# Altium schematic sheet Sheet1.SchDoc
size A4; SheetNumber: 1; SheetTotal: 1
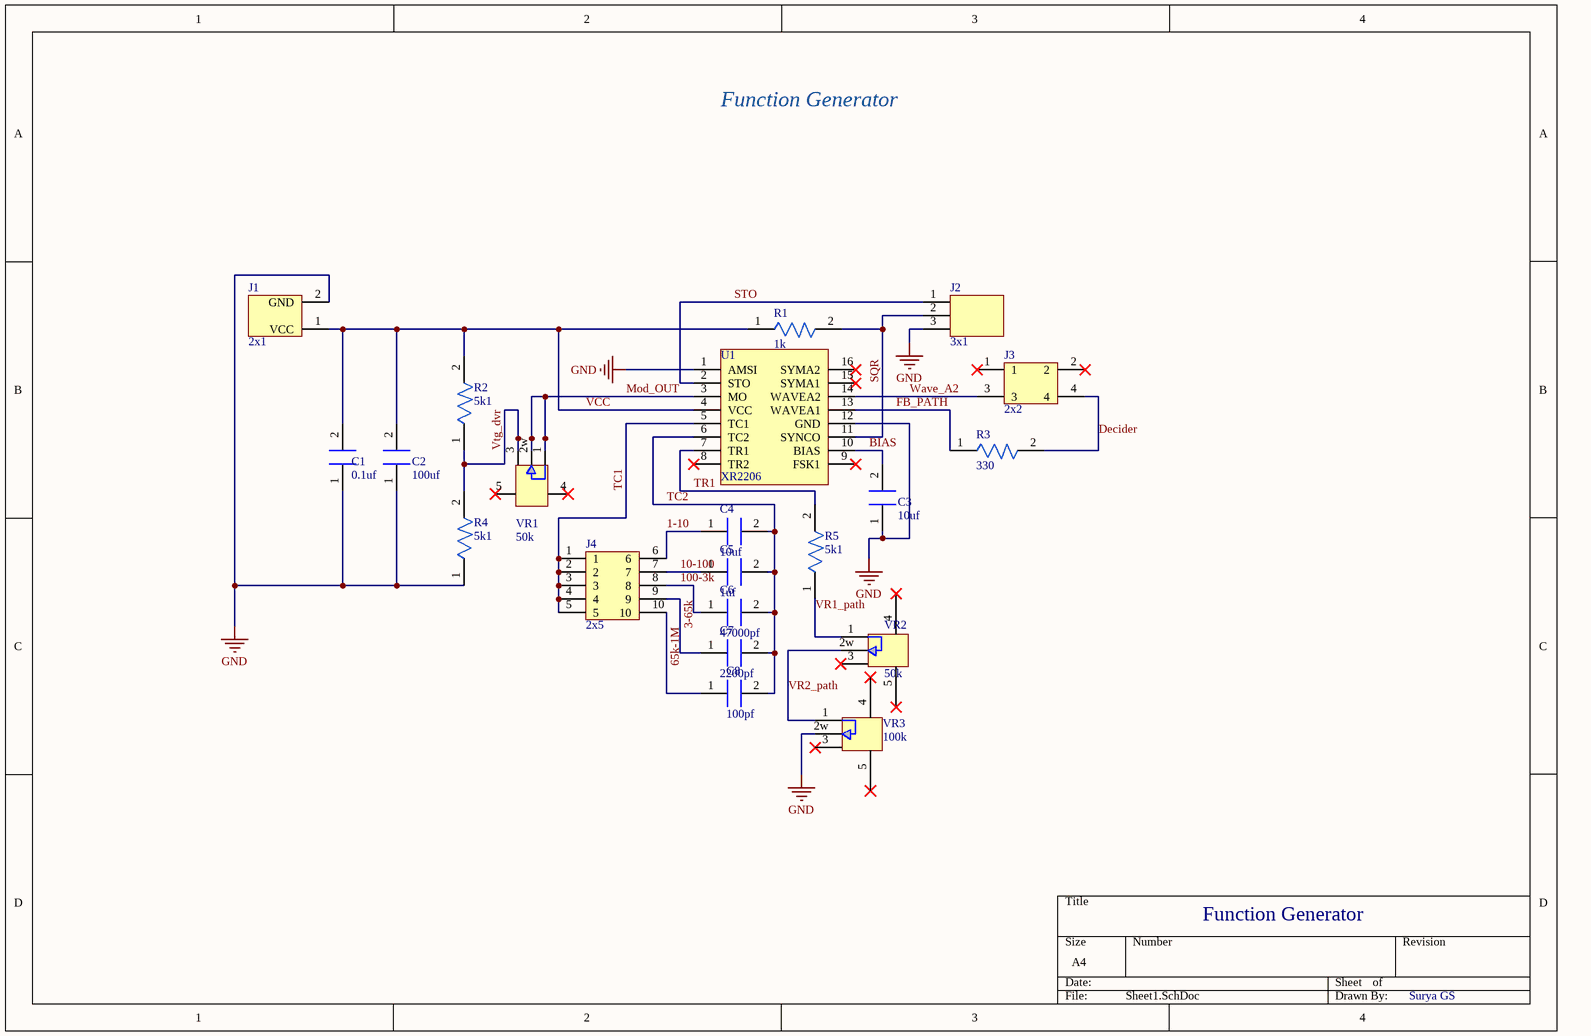
[diagram p0: Sheet1.SchDoc]

## Parts
C1  0.1uf  [PCBComponent_1]
C2  100uf  [PCBComponent_1]
C3  10uf  [PCBComponent_1]
C4  10uf  [PCBComponent_1]
C5  1uf  [PCBComponent_1]
C6  47000pf  [PCBComponent_1]
C7  2200pf  [PCBComponent_1]
C8  100pf  [PCBComponent_1]
J1  2x1  [PCBComponent_1 - duplicate4]
J2  3x1  [PCBComponent_1 - duplicate7]
J3  2x2  [PCBComponent_1 - duplicate6]
J4  2x5  [PCBComponent_1 - duplicate5]
R1  1k  [PCBComponent_1 - duplicate]
R2  5k1  [PCBComponent_1 - duplicate]
R3  330  [PCBComponent_1 - duplicate]
R4  5k1  [PCBComponent_1 - duplicate]
R5  5k1  [PCBComponent_1 - duplicate]
U1  XR2206  [PCBComponent_1 - duplicate2]
VR1  50k  [PCBComponent_1 - duplicate3]
VR2  50k  [PCBComponent_1 - duplicate3]
VR3  100k  [PCBComponent_1 - duplicate3]

## Nets
GND: C1.1 C2.1 C3.1 J1.2(GND) J2.3(GND) R4.1 U1.1(AMSI) U1.12(GND) VR3.2w(WPR)
1-10: C4.1 J4.6
3-65k: C7.1 J4.9
10-100: C5.1 J4.7
65k-1M: C8.1 J4.10
100-3k: C6.1 J4.8
BIAS: C3.2 U1.10(BIAS)
Decider: J3.4 R3.2
FB_PATH: R3.1 U1.13(WAVEA1)
Mod_OUT: U1.3(MO) VR1.1 VR1.2w(WPR)
SQR: J2.2(SQU) R1.2 U1.11(SYNCO)
STO: J2.1(SIN/TRI) U1.2(STO)
TC1: J4.1 J4.2 J4.3 J4.4 J4.5 U1.5(TC1)
TC2: C4.2 C5.2 C6.2 C7.2 C8.2 U1.6(TC2)
TR1: R5.2 U1.7(TR1)
VCC: C1.2 C2.2 J1.1(VCC) R1.1 R2.2 U1.4(VCC)
VR1_path: R5.1 VR2.1
VR2_path: VR2.2w(WPR) VR3.1
Vtg_dvr: R2.1 R4.2 VR1.3
Wave_A2: J3.3 U1.14(WAVEA2)

Not connected (* = marked no-connect by the designer): J3 1* 2*; U1 8(TR2)* 9(FSK1)* 15(SYMA1)* 16(SYMA2)*; VR1 4(WPR)* 5(WPR)*; VR2 3(12)* 4(WPR)* 5(WPR)*; VR3 3(12)* 4(WPR)* 5(WPR)*

## Notes on the sheet
- Function Generator
- Surya GS

## Library data of the parts
C1 = Capacitor_3: Manufacturer: United Chemi-Con; Manufacturer Part Number: KTD101B107M99A0B00; Value: 100µF; Dielectric Material: Ceramic; Lead/Base Style: Straight; Tolerance: 20%; Voltage Rating: 100V; Supplier: DigiKey; Supplier Part Number: 565-KTD101B107M99A0B00-ND; RoHS: Compliant; Category: Ceramic Capacitors; Stock: 1030; Pricing: 1=30.55, 10=24.126, 50=22.6442, 100=21.9445 (USD); Case/Package: Radial; China RoHS: Compliant; Contact Plating: Tin; Height: 20mm; Height - Seated (Max): 20.0152mm; Lead Pitch: 24.9936mm; Length: 28.5mm; Lifecycle Status: Production; Max Operating Temperature: 125°C; Min Operating Temperature: -55°C; Mounting Technology: Through Hole; Number of Terminals: 2; REACH SVHC: Yes; Terminal Pitch: 25mm; Voltage Rating (DC): 100V; Width: 9mm; ComponentLink1URL: https://datasheet.octopart.com:443/KTD101B107M99A0B00-Nippon-Chemicon-datasheet-182100469.pdf?src-supplier=IHS; ComponentLink1Description: https://datasheet.octopart.com:443/KTD101B107M99A0B00-Nippon-Chemicon-datasheet-182100469.pdf?src-supplier=IHS; ComponentLink2URL: https://datasheet.octopart.com:443/KTD101B107M99A0B00-United-Chemi-Con-datasheet-154730662.pdf?src-supplier=Electro+Sonic; ComponentLink2Description: https://datasheet.octopart.com:443/KTD101B107M99A0B00-United-Chemi-Con-datasheet-154730662.pdf?src-supplier=Electro+Sonic
C2 = Capacitor: Manufacturer: United Chemi-Con; Manufacturer Part Number: KTD101B107M99A0B00; Value: 100µF; Dielectric Material: Ceramic; Lead/Base Style: Straight; Tolerance: 20%; Voltage Rating: 100V; Supplier: DigiKey; Supplier Part Number: 565-KTD101B107M99A0B00-ND; RoHS: Compliant; Category: Ceramic Capacitors; Stock: 1030; Pricing: 1=30.55, 10=24.126, 50=22.6442, 100=21.9445 (USD); Case/Package: Radial; China RoHS: Compliant; Contact Plating: Tin; Height: 20mm; Height - Seated (Max): 20.0152mm; Lead Pitch: 24.9936mm; Length: 28.5mm; Lifecycle Status: Production; Max Operating Temperature: 125°C; Min Operating Temperature: -55°C; Mounting Technology: Through Hole; Number of Terminals: 2; REACH SVHC: Yes; Terminal Pitch: 25mm; Voltage Rating (DC): 100V; Width: 9mm; ComponentLink1URL: https://datasheet.octopart.com:443/KTD101B107M99A0B00-Nippon-Chemicon-datasheet-182100469.pdf?src-supplier=IHS; ComponentLink1Description: https://datasheet.octopart.com:443/KTD101B107M99A0B00-Nippon-Chemicon-datasheet-182100469.pdf?src-supplier=IHS; ComponentLink2URL: https://datasheet.octopart.com:443/KTD101B107M99A0B00-United-Chemi-Con-datasheet-154730662.pdf?src-supplier=Electro+Sonic; ComponentLink2Description: https://datasheet.octopart.com:443/KTD101B107M99A0B00-United-Chemi-Con-datasheet-154730662.pdf?src-supplier=Electro+Sonic
C3 = Capacitor_4: Manufacturer: United Chemi-Con; Manufacturer Part Number: KTD101B107M99A0B00; Value: 100µF; Dielectric Material: Ceramic; Lead/Base Style: Straight; Tolerance: 20%; Voltage Rating: 100V; Supplier: DigiKey; Supplier Part Number: 565-KTD101B107M99A0B00-ND; RoHS: Compliant; Category: Ceramic Capacitors; Stock: 1030; Pricing: 1=30.55, 10=24.126, 50=22.6442, 100=21.9445 (USD); Case/Package: Radial; China RoHS: Compliant; Contact Plating: Tin; Height: 20mm; Height - Seated (Max): 20.0152mm; Lead Pitch: 24.9936mm; Length: 28.5mm; Lifecycle Status: Production; Max Operating Temperature: 125°C; Min Operating Temperature: -55°C; Mounting Technology: Through Hole; Number of Terminals: 2; REACH SVHC: Yes; Terminal Pitch: 25mm; Voltage Rating (DC): 100V; Width: 9mm; ComponentLink1URL: https://datasheet.octopart.com:443/KTD101B107M99A0B00-Nippon-Chemicon-datasheet-182100469.pdf?src-supplier=IHS; ComponentLink1Description: https://datasheet.octopart.com:443/KTD101B107M99A0B00-Nippon-Chemicon-datasheet-182100469.pdf?src-supplier=IHS; ComponentLink2URL: https://datasheet.octopart.com:443/KTD101B107M99A0B00-United-Chemi-Con-datasheet-154730662.pdf?src-supplier=Electro+Sonic; ComponentLink2Description: https://datasheet.octopart.com:443/KTD101B107M99A0B00-United-Chemi-Con-datasheet-154730662.pdf?src-supplier=Electro+Sonic
C4 = Capacitor_5: Manufacturer: United Chemi-Con; Manufacturer Part Number: KTD101B107M99A0B00; Value: 100µF; Dielectric Material: Ceramic; Lead/Base Style: Straight; Tolerance: 20%; Voltage Rating: 100V; Supplier: DigiKey; Supplier Part Number: 565-KTD101B107M99A0B00-ND; RoHS: Compliant; Category: Ceramic Capacitors; Stock: 1030; Pricing: 1=30.55, 10=24.126, 50=22.6442, 100=21.9445 (USD); Case/Package: Radial; China RoHS: Compliant; Contact Plating: Tin; Height: 20mm; Height - Seated (Max): 20.0152mm; Lead Pitch: 24.9936mm; Length: 28.5mm; Lifecycle Status: Production; Max Operating Temperature: 125°C; Min Operating Temperature: -55°C; Mounting Technology: Through Hole; Number of Terminals: 2; REACH SVHC: Yes; Terminal Pitch: 25mm; Voltage Rating (DC): 100V; Width: 9mm; ComponentLink1URL: https://datasheet.octopart.com:443/KTD101B107M99A0B00-Nippon-Chemicon-datasheet-182100469.pdf?src-supplier=IHS; ComponentLink1Description: https://datasheet.octopart.com:443/KTD101B107M99A0B00-Nippon-Chemicon-datasheet-182100469.pdf?src-supplier=IHS; ComponentLink2URL: https://datasheet.octopart.com:443/KTD101B107M99A0B00-United-Chemi-Con-datasheet-154730662.pdf?src-supplier=Electro+Sonic; ComponentLink2Description: https://datasheet.octopart.com:443/KTD101B107M99A0B00-United-Chemi-Con-datasheet-154730662.pdf?src-supplier=Electro+Sonic
C5 = Capacitor_1: Manufacturer: United Chemi-Con; Manufacturer Part Number: KTD101B107M99A0B00; Value: 100µF; Dielectric Material: Ceramic; Lead/Base Style: Straight; Tolerance: 20%; Voltage Rating: 100V; Supplier: DigiKey; Supplier Part Number: 565-KTD101B107M99A0B00-ND; RoHS: Compliant; Category: Ceramic Capacitors; Stock: 1030; Pricing: 1=30.55, 10=24.126, 50=22.6442, 100=21.9445 (USD); Case/Package: Radial; China RoHS: Compliant; Contact Plating: Tin; Height: 20mm; Height - Seated (Max): 20.0152mm; Lead Pitch: 24.9936mm; Length: 28.5mm; Lifecycle Status: Production; Max Operating Temperature: 125°C; Min Operating Temperature: -55°C; Mounting Technology: Through Hole; Number of Terminals: 2; REACH SVHC: Yes; Terminal Pitch: 25mm; Voltage Rating (DC): 100V; Width: 9mm; ComponentLink1URL: https://datasheet.octopart.com:443/KTD101B107M99A0B00-Nippon-Chemicon-datasheet-182100469.pdf?src-supplier=IHS; ComponentLink1Description: https://datasheet.octopart.com:443/KTD101B107M99A0B00-Nippon-Chemicon-datasheet-182100469.pdf?src-supplier=IHS; ComponentLink2URL: https://datasheet.octopart.com:443/KTD101B107M99A0B00-United-Chemi-Con-datasheet-154730662.pdf?src-supplier=Electro+Sonic; ComponentLink2Description: https://datasheet.octopart.com:443/KTD101B107M99A0B00-United-Chemi-Con-datasheet-154730662.pdf?src-supplier=Electro+Sonic
C6 = Capacitor_2: Manufacturer: United Chemi-Con; Manufacturer Part Number: KTD101B107M99A0B00; Value: 100µF; Dielectric Material: Ceramic; Lead/Base Style: Straight; Tolerance: 20%; Voltage Rating: 100V; Supplier: DigiKey; Supplier Part Number: 565-KTD101B107M99A0B00-ND; RoHS: Compliant; Category: Ceramic Capacitors; Stock: 1030; Pricing: 1=30.55, 10=24.126, 50=22.6442, 100=21.9445 (USD); Case/Package: Radial; China RoHS: Compliant; Contact Plating: Tin; Height: 20mm; Height - Seated (Max): 20.0152mm; Lead Pitch: 24.9936mm; Length: 28.5mm; Lifecycle Status: Production; Max Operating Temperature: 125°C; Min Operating Temperature: -55°C; Mounting Technology: Through Hole; Number of Terminals: 2; REACH SVHC: Yes; Terminal Pitch: 25mm; Voltage Rating (DC): 100V; Width: 9mm; ComponentLink1URL: https://datasheet.octopart.com:443/KTD101B107M99A0B00-Nippon-Chemicon-datasheet-182100469.pdf?src-supplier=IHS; ComponentLink1Description: https://datasheet.octopart.com:443/KTD101B107M99A0B00-Nippon-Chemicon-datasheet-182100469.pdf?src-supplier=IHS; ComponentLink2URL: https://datasheet.octopart.com:443/KTD101B107M99A0B00-United-Chemi-Con-datasheet-154730662.pdf?src-supplier=Electro+Sonic; ComponentLink2Description: https://datasheet.octopart.com:443/KTD101B107M99A0B00-United-Chemi-Con-datasheet-154730662.pdf?src-supplier=Electro+Sonic
C7 = Capacitor_6: Manufacturer: United Chemi-Con; Manufacturer Part Number: KTD101B107M99A0B00; Value: 100µF; Dielectric Material: Ceramic; Lead/Base Style: Straight; Tolerance: 20%; Voltage Rating: 100V; Supplier: DigiKey; Supplier Part Number: 565-KTD101B107M99A0B00-ND; RoHS: Compliant; Category: Ceramic Capacitors; Stock: 1030; Pricing: 1=30.55, 10=24.126, 50=22.6442, 100=21.9445 (USD); Case/Package: Radial; China RoHS: Compliant; Contact Plating: Tin; Height: 20mm; Height - Seated (Max): 20.0152mm; Lead Pitch: 24.9936mm; Length: 28.5mm; Lifecycle Status: Production; Max Operating Temperature: 125°C; Min Operating Temperature: -55°C; Mounting Technology: Through Hole; Number of Terminals: 2; REACH SVHC: Yes; Terminal Pitch: 25mm; Voltage Rating (DC): 100V; Width: 9mm; ComponentLink1URL: https://datasheet.octopart.com:443/KTD101B107M99A0B00-Nippon-Chemicon-datasheet-182100469.pdf?src-supplier=IHS; ComponentLink1Description: https://datasheet.octopart.com:443/KTD101B107M99A0B00-Nippon-Chemicon-datasheet-182100469.pdf?src-supplier=IHS; ComponentLink2URL: https://datasheet.octopart.com:443/KTD101B107M99A0B00-United-Chemi-Con-datasheet-154730662.pdf?src-supplier=Electro+Sonic; ComponentLink2Description: https://datasheet.octopart.com:443/KTD101B107M99A0B00-United-Chemi-Con-datasheet-154730662.pdf?src-supplier=Electro+Sonic
C8 = Capacitor_7: Manufacturer: United Chemi-Con; Manufacturer Part Number: KTD101B107M99A0B00; Value: 100µF; Dielectric Material: Ceramic; Lead/Base Style: Straight; Tolerance: 20%; Voltage Rating: 100V; Supplier: DigiKey; Supplier Part Number: 565-KTD101B107M99A0B00-ND; RoHS: Compliant; Category: Ceramic Capacitors; Stock: 1030; Pricing: 1=30.55, 10=24.126, 50=22.6442, 100=21.9445 (USD); Case/Package: Radial; China RoHS: Compliant; Contact Plating: Tin; Height: 20mm; Height - Seated (Max): 20.0152mm; Lead Pitch: 24.9936mm; Length: 28.5mm; Lifecycle Status: Production; Max Operating Temperature: 125°C; Min Operating Temperature: -55°C; Mounting Technology: Through Hole; Number of Terminals: 2; REACH SVHC: Yes; Terminal Pitch: 25mm; Voltage Rating (DC): 100V; Width: 9mm; ComponentLink1URL: https://datasheet.octopart.com:443/KTD101B107M99A0B00-Nippon-Chemicon-datasheet-182100469.pdf?src-supplier=IHS; ComponentLink1Description: https://datasheet.octopart.com:443/KTD101B107M99A0B00-Nippon-Chemicon-datasheet-182100469.pdf?src-supplier=IHS; ComponentLink2URL: https://datasheet.octopart.com:443/KTD101B107M99A0B00-United-Chemi-Con-datasheet-154730662.pdf?src-supplier=Electro+Sonic; ComponentLink2Description: https://datasheet.octopart.com:443/KTD101B107M99A0B00-United-Chemi-Con-datasheet-154730662.pdf?src-supplier=Electro+Sonic
J1 = Header_2: Manufacturer: Sullins; Manufacturer Part Number: PPPC022LFBN-RC; Connector Type: Header, Socket; Current Rating: 3A; Dielectric Material: Polyester; Number of Positions: 4; Pitch: 2.54mm; Supplier: DigiKey; Supplier Part Number: S7105-ND; RoHS: Compliant; Category: Card Edge Connectors; Stock: 8090; Pricing: 1=0.46, 10=0.394, 100=0.3349, 500=0.29888, 1000=0.28461, 5000=0.25405, 10000=0.24193 (USD); Color: Black; Contact Gender: Female; Contact Material: Bronze; Contact Plating: Gold; Height: 8.5mm; Housing Material: Plastic; Lead Free: Lead Free; Length: 5.58mm; Lifecycle Status: Production; Mounting Technology: Through Hole; Pins: 4; Number of Rows: 2; Packaging: Bulk; REACH SVHC: Yes; Row Spacing: 2.54mm; Terminal Pitch: 2.54mm; Termination: Solder; Width: 5mm; ComponentLink1URL: https://datasheet.octopart.com:443/PPPC022LFBN-RC-Sullins-datasheet-138810743.pdf?src-supplier=IHS; ComponentLink1Description: https://datasheet.octopart.com:443/PPPC022LFBN-RC-Sullins-datasheet-138810743.pdf?src-supplier=IHS; ComponentLink2URL: https://datasheet.octopart.com:443/PPPC022LFBN-RC-Sullins-datasheet-41308905.pdf?src-supplier=Future+Electronics; ComponentLink2Description: https://datasheet.octopart.com:443/PPPC022LFBN-RC-Sullins-datasheet-41308905.pdf?src-supplier=Future+Electronics; ComponentLink3URL: https://datasheet.octopart.com:443/PPPC022LFBN-RC-Sullins-datasheet-12511165.pdf?src-supplier=Future+Electronics; ComponentLink3Description: https://datasheet.octopart.com:443/PPPC022LFBN-RC-Sullins-datasheet-12511165.pdf?src-supplier=Future+Electronics; ComponentLink4URL: https://datasheet.octopart.com:443/PPPC022LFBN-RC-Sullins-datasheet-12463.pdf?src-supplier=DigiKey; ComponentLink4Description: https://datasheet.octopart.com:443/PPPC022LFBN-RC-Sullins-datasheet-12463.pdf?src-supplier=DigiKey
J2 = Header_3: Manufacturer: Sullins; Manufacturer Part Number: PPPC022LFBN-RC; Connector Type: Header, Socket; Current Rating: 3A; Dielectric Material: Polyester; Number of Positions: 4; Pitch: 2.54mm; Supplier: DigiKey; Supplier Part Number: S7105-ND; RoHS: Compliant; Category: Card Edge Connectors; Stock: 8090; Pricing: 1=0.46, 10=0.394, 100=0.3349, 500=0.29888, 1000=0.28461, 5000=0.25405, 10000=0.24193 (USD); Color: Black; Contact Gender: Female; Contact Material: Bronze; Contact Plating: Gold; Height: 8.5mm; Housing Material: Plastic; Lead Free: Lead Free; Length: 5.58mm; Lifecycle Status: Production; Mounting Technology: Through Hole; Pins: 4; Number of Rows: 2; Packaging: Bulk; REACH SVHC: Yes; Row Spacing: 2.54mm; Terminal Pitch: 2.54mm; Termination: Solder; Width: 5mm; ComponentLink1URL: https://datasheet.octopart.com:443/PPPC022LFBN-RC-Sullins-datasheet-138810743.pdf?src-supplier=IHS; ComponentLink1Description: https://datasheet.octopart.com:443/PPPC022LFBN-RC-Sullins-datasheet-138810743.pdf?src-supplier=IHS; ComponentLink2URL: https://datasheet.octopart.com:443/PPPC022LFBN-RC-Sullins-datasheet-41308905.pdf?src-supplier=Future+Electronics; ComponentLink2Description: https://datasheet.octopart.com:443/PPPC022LFBN-RC-Sullins-datasheet-41308905.pdf?src-supplier=Future+Electronics; ComponentLink3URL: https://datasheet.octopart.com:443/PPPC022LFBN-RC-Sullins-datasheet-12511165.pdf?src-supplier=Future+Electronics; ComponentLink3Description: https://datasheet.octopart.com:443/PPPC022LFBN-RC-Sullins-datasheet-12511165.pdf?src-supplier=Future+Electronics; ComponentLink4URL: https://datasheet.octopart.com:443/PPPC022LFBN-RC-Sullins-datasheet-12463.pdf?src-supplier=DigiKey; ComponentLink4Description: https://datasheet.octopart.com:443/PPPC022LFBN-RC-Sullins-datasheet-12463.pdf?src-supplier=DigiKey
J3 = Header: Manufacturer: Sullins; Manufacturer Part Number: PPPC022LFBN-RC; Connector Type: Header, Socket; Current Rating: 3A; Dielectric Material: Polyester; Number of Positions: 4; Pitch: 2.54mm; Supplier: DigiKey; Supplier Part Number: S7105-ND; RoHS: Compliant; Category: Card Edge Connectors; Stock: 8090; Pricing: 1=0.46, 10=0.394, 100=0.3349, 500=0.29888, 1000=0.28461, 5000=0.25405, 10000=0.24193 (USD); Color: Black; Contact Gender: Female; Contact Material: Bronze; Contact Plating: Gold; Height: 8.5mm; Housing Material: Plastic; Lead Free: Lead Free; Length: 5.58mm; Lifecycle Status: Production; Mounting Technology: Through Hole; Pins: 4; Number of Rows: 2; Packaging: Bulk; REACH SVHC: Yes; Row Spacing: 2.54mm; Terminal Pitch: 2.54mm; Termination: Solder; Width: 5mm; ComponentLink1URL: https://datasheet.octopart.com:443/PPPC022LFBN-RC-Sullins-datasheet-138810743.pdf?src-supplier=IHS; ComponentLink1Description: https://datasheet.octopart.com:443/PPPC022LFBN-RC-Sullins-datasheet-138810743.pdf?src-supplier=IHS; ComponentLink2URL: https://datasheet.octopart.com:443/PPPC022LFBN-RC-Sullins-datasheet-41308905.pdf?src-supplier=Future+Electronics; ComponentLink2Description: https://datasheet.octopart.com:443/PPPC022LFBN-RC-Sullins-datasheet-41308905.pdf?src-supplier=Future+Electronics; ComponentLink3URL: https://datasheet.octopart.com:443/PPPC022LFBN-RC-Sullins-datasheet-12511165.pdf?src-supplier=Future+Electronics; ComponentLink3Description: https://datasheet.octopart.com:443/PPPC022LFBN-RC-Sullins-datasheet-12511165.pdf?src-supplier=Future+Electronics; ComponentLink4URL: https://datasheet.octopart.com:443/PPPC022LFBN-RC-Sullins-datasheet-12463.pdf?src-supplier=DigiKey; ComponentLink4Description: https://datasheet.octopart.com:443/PPPC022LFBN-RC-Sullins-datasheet-12463.pdf?src-supplier=DigiKey
J4 = Header_1: Manufacturer: Sullins; Manufacturer Part Number: PPPC022LFBN-RC; Connector Type: Header, Socket; Current Rating: 3A; Dielectric Material: Polyester; Number of Positions: 4; Pitch: 2.54mm; Supplier: DigiKey; Supplier Part Number: S7105-ND; RoHS: Compliant; Category: Card Edge Connectors; Stock: 8090; Pricing: 1=0.46, 10=0.394, 100=0.3349, 500=0.29888, 1000=0.28461, 5000=0.25405, 10000=0.24193 (USD); Color: Black; Contact Gender: Female; Contact Material: Bronze; Contact Plating: Gold; Height: 8.5mm; Housing Material: Plastic; Lead Free: Lead Free; Length: 5.58mm; Lifecycle Status: Production; Mounting Technology: Through Hole; Pins: 4; Number of Rows: 2; Packaging: Bulk; REACH SVHC: Yes; Row Spacing: 2.54mm; Terminal Pitch: 2.54mm; Termination: Solder; Width: 5mm; ComponentLink1URL: https://datasheet.octopart.com:443/PPPC022LFBN-RC-Sullins-datasheet-138810743.pdf?src-supplier=IHS; ComponentLink1Description: https://datasheet.octopart.com:443/PPPC022LFBN-RC-Sullins-datasheet-138810743.pdf?src-supplier=IHS; ComponentLink2URL: https://datasheet.octopart.com:443/PPPC022LFBN-RC-Sullins-datasheet-41308905.pdf?src-supplier=Future+Electronics; ComponentLink2Description: https://datasheet.octopart.com:443/PPPC022LFBN-RC-Sullins-datasheet-41308905.pdf?src-supplier=Future+Electronics; ComponentLink3URL: https://datasheet.octopart.com:443/PPPC022LFBN-RC-Sullins-datasheet-12511165.pdf?src-supplier=Future+Electronics; ComponentLink3Description: https://datasheet.octopart.com:443/PPPC022LFBN-RC-Sullins-datasheet-12511165.pdf?src-supplier=Future+Electronics; ComponentLink4URL: https://datasheet.octopart.com:443/PPPC022LFBN-RC-Sullins-datasheet-12463.pdf?src-supplier=DigiKey; ComponentLink4Description: https://datasheet.octopart.com:443/PPPC022LFBN-RC-Sullins-datasheet-12463.pdf?src-supplier=DigiKey
R1 = Resistor: Manufacturer: Yageo; Manufacturer Part Number: RC0402FR-07267KL; Tolerance: 1%; Additional Feature: LASER TRIMMABLE; Power: 62.5mW; Rated Temperature: 70°C; Value: 1kR; Working Voltage: 50V; Temperature Coefficient (ppm/Cel): 100; Package Height: 0.35mm; Package Length: 1mm; Package Width: 0.5mm; Supplier: Digikey; Supplier Part Number: YAG3079CT-ND; RoHS: Yes; Category: Chip SMD Resistors; Stock: 55854; Pricing: 1=0.1, 10=0.007, 100=0.0051, 1000=0.00306 (USD); Mounting Technology: Surface Mount; Pins: 2; Package Shape: Rectangular; Case/Package: 0402; Terminal Finish: Nickel; Min Operating Temperature: -55°C; Max Operating Temperature: 155°C; JESD-609 Code: e3; Resistor Type: FIXED RESISTOR; Construction: Chip; Packaging: Tape and Reel; Technology: METAL GLAZE/THICK FILM; Termination: Wraparound; Reach SVHC Compliant: Yes; RoHS Compliant: Yes; ComponentLink1URL: https://datasheet.ciiva.com:443/pdfs/VipMasterIC/IC/YAGO/YAGO-S-A0008145938/YAGO-S-A0008145938-1.pdf?src-supplier=IHS+Markit; ComponentLink1Description: https://datasheet.ciiva.com:443/pdfs/VipMasterIC/IC/YAGO/YAGO-S-A0008145938/YAGO-S-A0008145938-1.pdf?src-supplier=IHS+Markit; ComponentLink2URL: https://datasheet.ciiva.com/12577/pyu-rc0402-51-rohs-l-6-r-12577167.pdf?src-supplier=Mouser; ComponentLink2Description: https://datasheet.ciiva.com/12577/pyu-rc0402-51-rohs-l-6-r-12577167.pdf?src-supplier=Mouser; ComponentLink3URL: https://datasheet.ciiva.com/8886/pyu-rc0402-51-rohs-l-6-8886495.pdf?src-supplier=Avnet; ComponentLink3Description: https://datasheet.ciiva.com/8886/pyu-rc0402-51-rohs-l-6-8886495.pdf?src-supplier=Avnet
R2 R4 R5 = Resistor_2: Manufacturer: Yageo Group; Manufacturer Part Number: RC0603FR-075K1L; Max Power Dissipation: 100mW; Value: 5.1kΩ; Temperature Coefficient: 100ppm/°C; Tolerance: 1%; Voltage Rating: 75V; Voltage Rating (DC): 50V; Supplier: DigiKey; Supplier Part Number: 311-5.10KHRCT-ND; RoHS: Compliant; Category: Chip SMD Resistors; Stock: 929248; Pricing: 1=0.1, 10=0.009, 25=0.008, 50=0.0072, 100=0.0061, 250=0.00568 (USD); Case/Package: 0603; Case Code (Imperial): 0603; China RoHS: Non-Compliant; Composition: Thick Film; Depth: 800µm; Features: Moisture Resistant; Height: 450µm; Lead Free: Lead Free; Lifecycle Status: Production; Max Operating Temperature: 155°C; Military Standard: Not; Min Operating Temperature: -55°C; Mounting Technology: Surface Mount; Pins: 2; Number of Terminals: 2; Number of Terminations: 2; Packaging: Tape & Reel; Power Dissipation: 100mW; Power Rating: 100mW; REACH SVHC: Yes; Schedule B: 8533210045, 8533210045|8533210045, 8533210045|8533210045|8533210045, 8533210045|8533210045|8533210045|8533210045; Termination: SMD/SMT; Width: 800µm; Working Voltage: 75V; ComponentLink1URL: https://datasheet.octopart.com:443/RC0603FR-075K1L-Yageo-datasheet-175887523.pdf?src-supplier=IHS; ComponentLink1Description: https://datasheet.octopart.com:443/RC0603FR-075K1L-Yageo-datasheet-175887523.pdf?src-supplier=IHS; ComponentLink2URL: https://datasheet.octopart.com:443/RC0603FR-075K1L-Yageo-datasheet-103092701.pdf?src-supplier=Upverter; ComponentLink2Description: https://datasheet.octopart.com:443/RC0603FR-075K1L-Yageo-datasheet-103092701.pdf?src-supplier=Upverter; ComponentLink3URL: https://datasheet.octopart.com:443/RC0603FR-075K1L-Yageo-datasheet-8328172.pdf?src-supplier=Farnell; ComponentLink3Description: https://datasheet.octopart.com:443/RC0603FR-075K1L-Yageo-datasheet-8328172.pdf?src-supplier=Farnell; ComponentLink4URL: https://datasheet.octopart.com:443/RC0603FR-075K1L-Yageo-datasheet-62067350.pdf?src-supplier=Farnell; ComponentLink4Description: https://datasheet.octopart.com:443/RC0603FR-075K1L-Yageo-datasheet-62067350.pdf?src-supplier=Farnell; ComponentLink5URL: https://datasheet.octopart.com:443/RC0603FR-075K1L-Yageo-datasheet-34211833.pdf?src-supplier=element14+APAC; ComponentLink5Description: https://datasheet.octopart.com:443/RC0603FR-075K1L-Yageo-datasheet-34211833.pdf?src-supplier=element14+APAC; ComponentLink6URL: https://datasheet.octopart.com:443/RC0603FR-075K1L-Yageo-datasheet-164759695.pdf?src-supplier=Future+Electronics; ComponentLink6Description: https://datasheet.octopart.com:443/RC0603FR-075K1L-Yageo-datasheet-164759695.pdf?src-supplier=Future+Electronics; ComponentLink7URL: https://datasheet.octopart.com:443/RC0603FR-075K1L-Yageo-datasheet-137700087.pdf?src-supplier=Future+Electronics; ComponentLink7Description: https://datasheet.octopart.com:443/RC0603FR-075K1L-Yageo-datasheet-137700087.pdf?src-supplier=Future+Electronics; ComponentLink8URL: https://datasheet.octopart.com:443/RC0603FR-075K1L-Yageo-datasheet-15599030.pdf?src-supplier=Future+Electronics; ComponentLink8Description: https://datasheet.octopart.com:443/RC0603FR-075K1L-Yageo-datasheet-15599030.pdf?src-supplier=Future+Electronics; ComponentLink9URL: https://datasheet.octopart.com:443/RC0603FR-075K1L-Yageo-datasheet-12596169.pdf?src-supplier=Future+Electronics; ComponentLink9Description: https://datasheet.octopart.com:443/RC0603FR-075K1L-Yageo-datasheet-12596169.pdf?src-supplier=Future+Electronics; ComponentLink10URL: https://datasheet.octopart.com:443/RC0603FR-075K1L-Yageo-datasheet-503470.pdf?src-supplier=Future+Electronics; ComponentLink10Description: https://datasheet.octopart.com:443/RC0603FR-075K1L-Yageo-datasheet-503470.pdf?src-supplier=Future+Electronics; ComponentLink11URL: https://datasheet.octopart.com:443/RC0603FR-075K1L-Yageo-datasheet-148775077.pdf?src-supplier=TME; ComponentLink11Description: https://datasheet.octopart.com:443/RC0603FR-075K1L-Yageo-datasheet-148775077.pdf?src-supplier=TME; ComponentLink12URL: https://datasheet.octopart.com:443/RC0603FR-075K1L-Yageo-datasheet-79472498.pdf?src-supplier=Megastar; ComponentLink12Description: https://datasheet.octopart.com:443/RC0603FR-075K1L-Yageo-datasheet-79472498.pdf?src-supplier=Megastar; ComponentLink13URL: https://datasheet.octopart.com/RC0603FR-075K1L-Yageo-datasheet-73766026.pdf; ComponentLink13Description: https://datasheet.octopart.com/RC0603FR-075K1L-Yageo-datasheet-73766026.pdf; ComponentLink14URL: https://datasheet.octopart.com:443/RC0603FR-075K1L-Yageo-datasheet-118562.pdf?src-supplier=DigiKey; ComponentLink14Description: https://datasheet.octopart.com:443/RC0603FR-075K1L-Yageo-datasheet-118562.pdf?src-supplier=DigiKey; ComponentLink15URL: http://sigma.octopart.com:80/rohs_statement/Yageo-company-2.pdf?src-supplier=Compliance+Statements; ComponentLink15Description: http://sigma.octopart.com:80/rohs_statement/Yageo-company-2.pdf?src-supplier=Compliance+Statements; ComponentLink16URL: http://sigma.octopart.com:80/conflict_mineral_statement/Yageo-company-3.pdf?src-supplier=Compliance+Statements; ComponentLink16Description: http://sigma.octopart.com:80/conflict_mineral_statement/Yageo-company-3.pdf?src-supplier=Compliance+Statements
R3 = Resistor_1: Manufacturer: TE Connectivity; Manufacturer Part Number: CRGP2512F330R; Manufacturer Lifecycle Status: ACTIVE; Operating Supply Voltage: 500V; Power Dissipation: 2W; Value: 330Ω; Temperature Coefficient: 100ppm/°C; Tolerance: 1%; Supplier: DigiKey; Supplier Part Number: A130715CT-ND; RoHS: Compliant; Category: Chip SMD Resistors; Stock: 8171; Pricing: 1=0.5, 10=0.291, 25=0.2428, 50=0.2154, 100=0.1937, 250=0.1762, 500=0.14896 (USD); Ambient Temperature Range High: 70°C; Case/Package: 2512; China RoHS: Non-Compliant; Composition: Thick Film; Height: 550µm; Lifecycle Status: Production; Max Operating Temperature: 155°C; Min Operating Temperature: -55°C; Mounting Technology: Surface Mount; Number of Terminals: 2; Packaging: Cut Tape; Power Rating: 2W; REACH SVHC: Yes; Schedule B: 8533210025, 8533210025|8533210025, 8533210025|8533210025|8533210025, 8533210025|8533210025|8533210025|8533210025; Voltage Rating: 500V; Voltage Rating (DC): 500V; Width: 3.2mm; Working Voltage: 500V; ComponentLink1URL: https://sigma.octopart.com:443/114728873/technical_drawing/TE-Connectivity-CRGP2512F330R.pdf?src-supplier=TE+Connectivity; ComponentLink1Description: https://sigma.octopart.com:443/114728873/technical_drawing/TE-Connectivity-CRGP2512F330R.pdf?src-supplier=TE+Connectivity; ComponentLink2URL: https://datasheet.octopart.com:443/CRGP2512F330R-TE-Connectivity-datasheet-114718804.pdf?src-supplier=element14+APAC; ComponentLink2Description: https://datasheet.octopart.com:443/CRGP2512F330R-TE-Connectivity-datasheet-114718804.pdf?src-supplier=element14+APAC; ComponentLink3URL: https://datasheet.octopart.com:443/CRGP2512F330R-TE-Connectivity-datasheet-138898427.pdf?src-supplier=Upverter; ComponentLink3Description: https://datasheet.octopart.com:443/CRGP2512F330R-TE-Connectivity-datasheet-138898427.pdf?src-supplier=Upverter; ComponentLink4URL: https://datasheet.octopart.com:443/1-2176331-9-TE-Connectivity---AMP-datasheet-184935180.pdf?src-supplier=Master+Electronics; ComponentLink4Description: https://datasheet.octopart.com:443/1-2176331-9-TE-Connectivity---AMP-datasheet-184935180.pdf?src-supplier=Master+Electronics; ComponentLink5URL: https://datasheet.octopart.com:443/1-2176331-9-TE-Connectivity-datasheet-176339768.pdf?src-supplier=Sager+Electronics; ComponentLink5Description: https://datasheet.octopart.com:443/1-2176331-9-TE-Connectivity-datasheet-176339768.pdf?src-supplier=Sager+Electronics; ComponentLink6URL: https://datasheet.octopart.com:443/1-2176331-9-TE-Connectivity-datasheet-156004650.pdf?src-supplier=Future+Electronics; ComponentLink6Description: https://datasheet.octopart.com:443/1-2176331-9-TE-Connectivity-datasheet-156004650.pdf?src-supplier=Future+Electronics
U1 = XR2206CP-F
VR1 = Potentiometer: Manufacturer: Bourns; Manufacturer Part Number: PV36W503C01B00; Lead Diameter: 510µm; Lead Length: 6.4mm; Max Power Dissipation: 500mW; Number of Turns: 25; Value: 50kΩ; Temperature Coefficient: 100ppm/°C; Tolerance: 10%; Supplier: DigiKey; Supplier Part Number: 118-PV36W503C01B00-ND; RoHS: Compliant; Category: Variable Resistors and Potentiometers; Stock: 4549; Pricing: 1=1.53, 10=1.291, 25=1.2048, 50=1.1432, 100=1.0844, 300=0.99703, 500=0.95864, 1000=0.90877, 5000=0.80229 (USD); Composition: Cermet; Contact Plating: Tin; Height: 10.03mm; Lifecycle Status: Production; Max Operating Temperature: 125°C; Min Operating Temperature: -55°C; Mounting Technology: Through Hole; Number of Terminals: 3; Power Dissipation: 500mW; REACH SVHC: No; Schedule B: 8533400080, 8533400080|8533400080|8533400080|8533400080|8533400080; Termination: PC Pins; Width: 4.83mm; ComponentLink1URL: https://datasheet.octopart.com:443/PV36W503C01B00-Bourns-datasheet-182141976.pdf?src-supplier=JRH+Electronics; ComponentLink1Description: https://datasheet.octopart.com:443/PV36W503C01B00-Bourns-datasheet-182141976.pdf?src-supplier=JRH+Electronics; ComponentLink2URL: https://datasheet.octopart.com:443/PV36W503C01B00-Bourns-datasheet-154729827.pdf?src-supplier=Electro+Sonic; ComponentLink2Description: https://datasheet.octopart.com:443/PV36W503C01B00-Bourns-datasheet-154729827.pdf?src-supplier=Electro+Sonic; ComponentLink3URL: https://datasheet.octopart.com:443/PV36W503C01B00-Bourns-datasheet-177040424.pdf?src-supplier=Burklin+Elektronik; ComponentLink3Description: https://datasheet.octopart.com:443/PV36W503C01B00-Bourns-datasheet-177040424.pdf?src-supplier=Burklin+Elektronik; ComponentLink4URL: https://datasheet.octopart.com:443/PV36W503C01B00-Bourns-datasheet-165058412.pdf?src-supplier=Burklin+Elektronik; ComponentLink4Description: https://datasheet.octopart.com:443/PV36W503C01B00-Bourns-datasheet-165058412.pdf?src-supplier=Burklin+Elektronik; ComponentLink5URL: https://datasheet.octopart.com:443/PV36W503C01B00-Bourns-datasheet-103142593.pdf?src-supplier=TME; ComponentLink5Description: https://datasheet.octopart.com:443/PV36W503C01B00-Bourns-datasheet-103142593.pdf?src-supplier=TME; ComponentLink6URL: http://sigma.octopart.com:80/conflict_mineral_statement/Bourns-company-36.pdf?src-supplier=Compliance+Statements; ComponentLink6Description: http://sigma.octopart.com:80/conflict_mineral_statement/Bourns-company-36.pdf?src-supplier=Compliance+Statements
VR2 = Potentiometer_1: Manufacturer: Bourns; Manufacturer Part Number: PV36W503C01B00; Lead Diameter: 510µm; Lead Length: 6.4mm; Max Power Dissipation: 500mW; Number of Turns: 25; Value: 50kΩ; Temperature Coefficient: 100ppm/°C; Tolerance: 10%; Supplier: DigiKey; Supplier Part Number: 118-PV36W503C01B00-ND; RoHS: Compliant; Category: Variable Resistors and Potentiometers; Stock: 4549; Pricing: 1=1.53, 10=1.291, 25=1.2048, 50=1.1432, 100=1.0844, 300=0.99703, 500=0.95864, 1000=0.90877, 5000=0.80229 (USD); Composition: Cermet; Contact Plating: Tin; Height: 10.03mm; Lifecycle Status: Production; Max Operating Temperature: 125°C; Min Operating Temperature: -55°C; Mounting Technology: Through Hole; Number of Terminals: 3; Power Dissipation: 500mW; REACH SVHC: No; Schedule B: 8533400080, 8533400080|8533400080|8533400080|8533400080|8533400080; Termination: PC Pins; Width: 4.83mm; ComponentLink1URL: https://datasheet.octopart.com:443/PV36W503C01B00-Bourns-datasheet-182141976.pdf?src-supplier=JRH+Electronics; ComponentLink1Description: https://datasheet.octopart.com:443/PV36W503C01B00-Bourns-datasheet-182141976.pdf?src-supplier=JRH+Electronics; ComponentLink2URL: https://datasheet.octopart.com:443/PV36W503C01B00-Bourns-datasheet-154729827.pdf?src-supplier=Electro+Sonic; ComponentLink2Description: https://datasheet.octopart.com:443/PV36W503C01B00-Bourns-datasheet-154729827.pdf?src-supplier=Electro+Sonic; ComponentLink3URL: https://datasheet.octopart.com:443/PV36W503C01B00-Bourns-datasheet-177040424.pdf?src-supplier=Burklin+Elektronik; ComponentLink3Description: https://datasheet.octopart.com:443/PV36W503C01B00-Bourns-datasheet-177040424.pdf?src-supplier=Burklin+Elektronik; ComponentLink4URL: https://datasheet.octopart.com:443/PV36W503C01B00-Bourns-datasheet-165058412.pdf?src-supplier=Burklin+Elektronik; ComponentLink4Description: https://datasheet.octopart.com:443/PV36W503C01B00-Bourns-datasheet-165058412.pdf?src-supplier=Burklin+Elektronik; ComponentLink5URL: https://datasheet.octopart.com:443/PV36W503C01B00-Bourns-datasheet-103142593.pdf?src-supplier=TME; ComponentLink5Description: https://datasheet.octopart.com:443/PV36W503C01B00-Bourns-datasheet-103142593.pdf?src-supplier=TME; ComponentLink6URL: http://sigma.octopart.com:80/conflict_mineral_statement/Bourns-company-36.pdf?src-supplier=Compliance+Statements; ComponentLink6Description: http://sigma.octopart.com:80/conflict_mineral_statement/Bourns-company-36.pdf?src-supplier=Compliance+Statements
VR3 = Potentiometer_2: Manufacturer: Bourns; Manufacturer Part Number: PV36W503C01B00; Lead Diameter: 510µm; Lead Length: 6.4mm; Max Power Dissipation: 500mW; Number of Turns: 25; Value: 50kΩ; Temperature Coefficient: 100ppm/°C; Tolerance: 10%; Supplier: DigiKey; Supplier Part Number: 118-PV36W503C01B00-ND; RoHS: Compliant; Category: Variable Resistors and Potentiometers; Stock: 4549; Pricing: 1=1.53, 10=1.291, 25=1.2048, 50=1.1432, 100=1.0844, 300=0.99703, 500=0.95864, 1000=0.90877, 5000=0.80229 (USD); Composition: Cermet; Contact Plating: Tin; Height: 10.03mm; Lifecycle Status: Production; Max Operating Temperature: 125°C; Min Operating Temperature: -55°C; Mounting Technology: Through Hole; Number of Terminals: 3; Power Dissipation: 500mW; REACH SVHC: No; Schedule B: 8533400080, 8533400080|8533400080|8533400080|8533400080|8533400080; Termination: PC Pins; Width: 4.83mm; ComponentLink1URL: https://datasheet.octopart.com:443/PV36W503C01B00-Bourns-datasheet-182141976.pdf?src-supplier=JRH+Electronics; ComponentLink1Description: https://datasheet.octopart.com:443/PV36W503C01B00-Bourns-datasheet-182141976.pdf?src-supplier=JRH+Electronics; ComponentLink2URL: https://datasheet.octopart.com:443/PV36W503C01B00-Bourns-datasheet-154729827.pdf?src-supplier=Electro+Sonic; ComponentLink2Description: https://datasheet.octopart.com:443/PV36W503C01B00-Bourns-datasheet-154729827.pdf?src-supplier=Electro+Sonic; ComponentLink3URL: https://datasheet.octopart.com:443/PV36W503C01B00-Bourns-datasheet-177040424.pdf?src-supplier=Burklin+Elektronik; ComponentLink3Description: https://datasheet.octopart.com:443/PV36W503C01B00-Bourns-datasheet-177040424.pdf?src-supplier=Burklin+Elektronik; ComponentLink4URL: https://datasheet.octopart.com:443/PV36W503C01B00-Bourns-datasheet-165058412.pdf?src-supplier=Burklin+Elektronik; ComponentLink4Description: https://datasheet.octopart.com:443/PV36W503C01B00-Bourns-datasheet-165058412.pdf?src-supplier=Burklin+Elektronik; ComponentLink5URL: https://datasheet.octopart.com:443/PV36W503C01B00-Bourns-datasheet-103142593.pdf?src-supplier=TME; ComponentLink5Description: https://datasheet.octopart.com:443/PV36W503C01B00-Bourns-datasheet-103142593.pdf?src-supplier=TME; ComponentLink6URL: http://sigma.octopart.com:80/conflict_mineral_statement/Bourns-company-36.pdf?src-supplier=Compliance+Statements; ComponentLink6Description: http://sigma.octopart.com:80/conflict_mineral_statement/Bourns-company-36.pdf?src-supplier=Compliance+Statements